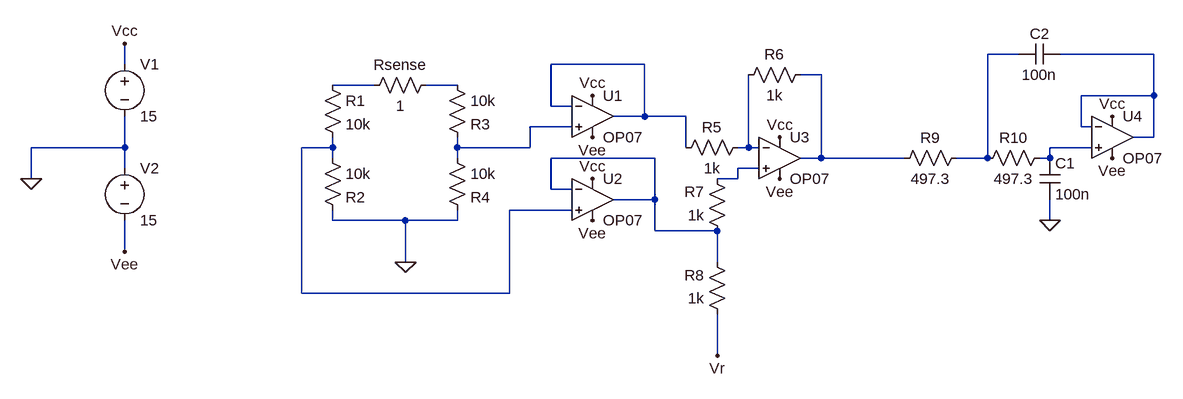
[diagram p0: schematic design.asc]
design.asc, the LTspice schematic file:
Version 4
SHEET 1 1264 680
WIRE 1040 64 992 64
WIRE 1248 64 1104 64
WIRE -336 80 -336 48
WIRE 464 80 320 80
WIRE 736 96 704 96
WIRE 48 112 -16 112
WIRE 176 112 128 112
WIRE 1248 128 1248 64
WIRE 1248 128 1136 128
WIRE 320 144 320 80
WIRE 352 144 320 144
WIRE 464 160 464 80
WIRE 464 160 416 160
WIRE 528 160 464 160
WIRE 352 176 288 176
WIRE 1136 176 1136 128
WIRE 1152 176 1136 176
WIRE 1248 192 1248 128
WIRE 1248 192 1216 192
WIRE -336 208 -336 160
WIRE -336 208 -480 208
WIRE -16 208 -16 192
WIRE -16 208 -64 208
WIRE 176 208 176 192
WIRE 288 208 288 176
WIRE 288 208 176 208
WIRE 528 208 528 160
WIRE 624 208 624 96
WIRE 624 208 608 208
WIRE 640 208 624 208
WIRE 1152 208 1088 208
WIRE -16 224 -16 208
WIRE 176 224 176 208
WIRE 480 224 320 224
WIRE 736 224 736 96
WIRE 736 224 704 224
WIRE 864 224 736 224
WIRE 992 224 992 64
WIRE 992 224 944 224
WIRE 1088 224 1088 208
WIRE 1088 224 1072 224
WIRE -336 240 -336 208
WIRE 640 240 608 240
WIRE -480 256 -480 208
WIRE 608 256 608 240
WIRE 608 256 576 256
WIRE 320 272 320 224
WIRE 352 272 320 272
WIRE 480 288 480 224
WIRE 480 288 416 288
WIRE 352 304 256 304
WIRE -16 320 -16 304
WIRE 96 320 -16 320
WIRE 176 320 176 304
WIRE 176 320 96 320
WIRE 1088 320 1088 288
WIRE 480 336 480 288
WIRE 576 336 480 336
WIRE -336 368 -336 320
WIRE 96 384 96 320
WIRE 576 384 576 336
WIRE -64 432 -64 208
WIRE 256 432 256 304
WIRE 256 432 -64 432
WIRE 576 528 576 464
FLAG 96 384 0
FLAG 1088 320 0
FLAG 576 528 Vr
FLAG -480 256 0
FLAG -336 48 Vcc
FLAG -336 368 Vee
FLAG 384 128 Vcc
FLAG 384 256 Vcc
FLAG 672 192 Vcc
FLAG 1184 160 Vcc
FLAG 384 192 Vee
FLAG 384 320 Vee
FLAG 672 256 Vee
FLAG 1184 224 Vee
SYMBOL res -32 96 R0
SYMATTR InstName R1
SYMATTR Value 10k
SYMBOL res -32 208 R0
SYMATTR InstName 10k
SYMATTR Value R2
SYMBOL res 160 96 R0
SYMATTR InstName 10k
SYMATTR Value R3
SYMBOL res 160 208 R0
SYMATTR InstName 10k
SYMATTR Value R4
SYMBOL OpAmps\\OP07 384 96 R0
SYMATTR InstName U1
SYMBOL OpAmps\\OP07 384 224 R0
SYMATTR InstName U2
SYMBOL OpAmps\\OP07 672 160 R0
SYMATTR InstName U3
SYMBOL OpAmps\\OP07 1184 128 R0
SYMATTR InstName U4
SYMBOL res 720 80 R90
WINDOW 0 0 56 VBottom 2
WINDOW 3 32 56 VTop 2
SYMATTR InstName R6
SYMATTR Value 1k
SYMBOL res 624 192 R90
WINDOW 0 0 56 VBottom 2
WINDOW 3 32 56 VTop 2
SYMATTR InstName R5
SYMATTR Value 1k
SYMBOL res 592 352 R180
WINDOW 0 36 76 Left 2
WINDOW 3 36 40 Left 2
SYMATTR InstName R7
SYMATTR Value 1k
SYMBOL res 592 480 R180
WINDOW 0 36 76 Left 2
WINDOW 3 36 40 Left 2
SYMATTR InstName R8
SYMATTR Value 1k
SYMBOL cap 1072 224 R0
SYMATTR InstName C1
SYMATTR Value 100n
SYMBOL res 1088 208 R90
WINDOW 0 0 56 VBottom 2
WINDOW 3 32 56 VTop 2
SYMATTR InstName R10
SYMATTR Value 497.3
SYMBOL cap 1104 48 R90
WINDOW 0 0 32 VBottom 2
WINDOW 3 32 32 VTop 2
SYMATTR InstName C2
SYMATTR Value 100n
SYMBOL res 960 208 R90
WINDOW 0 0 56 VBottom 2
WINDOW 3 32 56 VTop 2
SYMATTR InstName R9
SYMATTR Value 497.3
SYMBOL res 144 96 R90
WINDOW 0 0 56 VBottom 2
WINDOW 3 32 56 VTop 2
SYMATTR InstName Rsense
SYMATTR Value 1
SYMBOL voltage -336 64 R0
WINDOW 123 0 0 Left 0
WINDOW 39 0 0 Left 0
SYMATTR InstName V1
SYMATTR Value 15
SYMBOL voltage -336 224 R0
WINDOW 123 0 0 Left 0
WINDOW 39 0 0 Left 0
SYMATTR InstName V2
SYMATTR Value 15

The netlist it stands for:
* design.asc
R1 N005 N008 10k
R§10k N008 0 R2
R§10k N006 N007 R3
R§10k N007 0 R4
XU1 N007 N003 Vcc Vee N003 LT1001  ; OP07, pins In+ In- V+ V- OUT
XU2 N008 N011 Vcc Vee N011 LT1001  ; OP07, pins In+ In- V+ V- OUT
XU3 N012 N009 Vcc Vee N004 LT1001  ; OP07, pins In+ In- V+ V- OUT
XU4 N010 N002 Vcc Vee N002 LT1001  ; OP07, pins In+ In- V+ V- OUT
R6 N004 N009 1k
R5 N009 N003 1k
R7 N011 N012 1k
R8 Vr N011 1k
C1 N010 0 100n
R10 N010 N001 497.3
C2 N002 N001 100n
R9 N001 N004 497.3
Rsense N006 N005 1
V1 Vcc 0 15
V2 0 Vee 15
.lib LTC.lib
.backanno
.end